# Altium schematic sheet CC110L.SchDoc
size A4
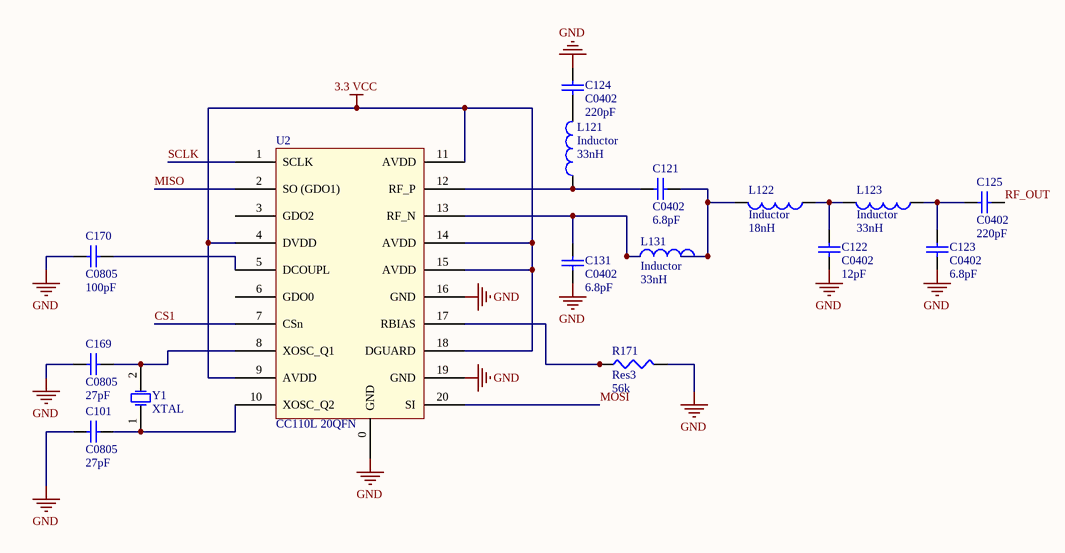
[diagram p0: CC110L.SchDoc]

## Parts
C101  C0805  value 27pF  [0805]
C121  C0402  value 6.8pF  [0402]
C122  C0402  value 12pF  [0402]
C123  C0402  value 6.8pF  [0402]
C124  C0402  value 220pF  [0402]
C125  C0402  value 220pF  [0402]
C131  C0402  value 6.8pF  [0402]
C169  C0805  value 27pF  [0805]
C170  C0805  value 100pF  [0805]
L121  Inductor  value 33nH  [0402-A]
L122  Inductor  value 18nH  [0402-A]
L123  Inductor  value 33nH  [0402-A]
L131  Inductor  value 33nH  [0402-A]
R171  Res3  value 56k  [J1-0603]
U2  CC110L 20QFN  [20QFN]
Y1  XTAL  [R38]

## Nets
3.3 VCC: U2.4(DVDD) U2.9(AVDD) U2.11(AVDD) U2.14(AVDD) U2.15(AVDD) U2.18(DGUARD)
GND: C101.1 C122.1 C123.1 C124.2 C131.1 C169.1 C170.1 R171.2 U2.0(GND) U2.16(GND) U2.19(GND)
CS1: U2.7(CSn)
MISO: U2.2(SO_(GDO1))
MOSI: U2.20(SI)
RF_OUT: C125.2
SCLK: U2.1(SCLK)
NetC101_2: C101.2 U2.10(XOSC_Q2) Y1.1(OSC1)
NetC121_1: C121.1 L121.1 U2.12(RF_P)
NetC121_2: C121.2 L122.2 L131.2
NetC122_2: C122.2 L122.1 L123.2
NetC123_2: C123.2 C125.1 L123.1
NetC124_1: C124.1 L121.2
NetC131_2: C131.2 L131.1 U2.13(RF_N)
NetC169_2: C169.2 U2.8(XOSC_Q1) Y1.2(OSC2)
NetC170_2: C170.2 U2.5(DCOUPL)
NetR171_1: R171.1 U2.17(RBIAS)

Not connected (* = marked no-connect by the designer): U2 3(GDO2) 6(GDO0)

## Library data of the parts
C101 C169 C170 = C0805: Ceramic Chip Capacitor - Standard; Note: Footprint corresponds to dimensions for bulk cassette packaging. This case size has tightened tolerances.; Published: 17-Jul-2002; LatestRevisionDate: 19-Mar-2004; LatestRevisionNote: Silkscreen size reduced.; DatasheetDocument: Mar-2001; PackageDocument: Mar-2001; PackageReference: 0805; Publisher: Altium Limited; Code_JEITA: 0805; Code_IPC: 2012[0805]; ComponentLink1Description: Manufacturer Link; ComponentLink1URL: http://www.kemet.com/; ComponentLink2Description: Datasheet; ComponentLink2URL: http://www.kemet.com/kemet/web/homepage/kechome.nsf/vapubfilesname/F3102TA.pdf/$file/F3102TA.pdf
C121-C125 C131 = C0402: Ceramic Chip Capacitor - Standard; Note: Footprint corresponds to dimensions for bulk cassette packaging. This case size has tightened tolerances.; Published: 17-Jul-2002; LatestRevisionDate: 19-Mar-2004; LatestRevisionNote: Silkscreen size reduced.; DatasheetDocument: Mar-2001; PackageDocument: Mar-2001; PackageReference: 0402; Publisher: Altium Limited; Code_JEITA: 0402; Code_IPC: 1005 [0402]; ComponentLink1Description: Manufacturer Link; ComponentLink1URL: http://www.kemet.com/; ComponentLink2Description: Datasheet; ComponentLink2URL: http://www.kemet.com/kemet/web/homepage/kechome.nsf/vapubfilesname/F3102TA.pdf/$file/F3102TA.pdf
L121-L123 L131 = Inductor: Code_IEC: 1005; Published: 8-Jun-2000; LatestRevisionDate: 29-May-2009; LatestRevisionNote: IPC-7351 Footprint Added.; PackageReference: 0402-A; Publisher: Altium Limited; PackageDescription: Chip Inductor; Code_JEITA: 0402
R171 = Res3: Resistor; Published: 8-Jun-2000; LatestRevisionDate: 29-May-2009; LatestRevisionNote: IPC-7351 Footprint Added.; PackageReference: J1-0603; Publisher: Altium Limited; PackageDescription: Chip Resistor
Y1 = XTAL: Crystal Oscillator; Published: 8-Jun-2000; LatestRevisionDate: 17-Jul-2002; LatestRevisionNote: Re-released for DXP Platform.; PackageReference: R38; Publisher: Altium Limited; PackageDescription: Crystal, Thru-Hole; 2 Leads; Body 3.1 x 8.2 mm (Dia.xH)